# EAGLE design StartStopSwitch (EAGLE 9.0.0)
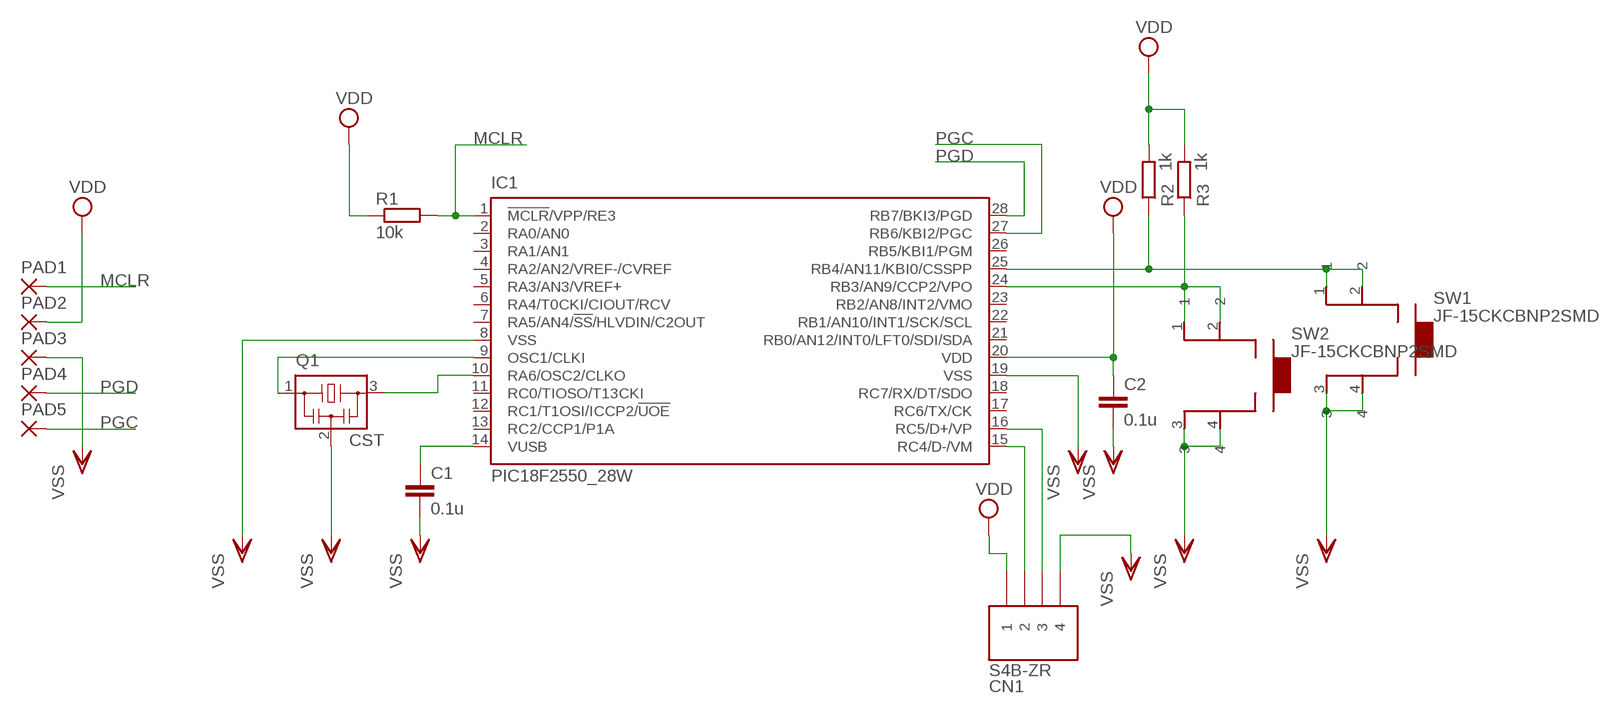
[diagram p0: schematic, sheet 1]

## Parts
C1  0.1u  C-EUC2012  [C2012]
C2  0.1u  C-EUC2012  [C2012]
CN1  S4B-ZR  [S4B-ZR]
IC1  PIC18F2550_28W  [SO28W]
PAD1  WIREPADSMD1,27-254  [SMD1,27-2,54]
PAD2  WIREPADSMD1,27-254  [SMD1,27-2,54]
PAD3  WIREPADSMD1,27-254  [SMD1,27-2,54]
PAD4  WIREPADSMD1,27-254  [SMD1,27-2,54]
PAD5  WIREPADSMD1,27-254  [SMD1,27-2,54]
Q1  CST  CSTCRMINI  [CSTCR6M-MINI]
R1  10k  R-EU_R0805  [R0805]
R2  1k  R-EU_R0805  [R0805]
R3  1k  R-EU_R0805  [R0805]
SW1  JF-15CKCBNP2SMD  [JF-15CKCBNP2-SMD]
SW2  JF-15CKCBNP2SMD  [JF-15CKCBNP2-SMD]

## Nets
24: IC1.24(RB3/AN9/CCP2/VPO) R3.1 SW2.1 SW2.2
25: IC1.25(RB4/AN11/KBI0/CSSPP) R2.1 SW1.1 SW1.2
D+: CN1.3 IC1.16(RC5/D+/VP)
D-: CN1.2 IC1.15(RC4/D-/VM)
MCLR: IC1.1(!MCLR!/VPP/RE3) PAD1.1(P) R1.2
N$1: C1.1 IC1.14(VUSB)
N$2: IC1.9(OSC1/CLKI) Q1.1
N$3: IC1.10(RA6/OSC2/CLKO) Q1.3
PGC: IC1.27(RB6/KBI2/PGC) PAD5.1(P)
PGD: IC1.28(RB7/BKI3/PGD) PAD4.1(P)
VDD: C2.1 CN1.1 IC1.20(VDD) PAD2.1(P) R1.1 R2.2 R3.2
VSS: C1.2 C2.2 CN1.4 IC1.8(VSS) IC1.19(VSS) PAD3.1(P) Q1.2 SW1.3 SW1.4 SW2.3 SW2.4
Unconnected: IC1.2(RA0/AN0) IC1.3(RA1/AN1) IC1.4(RA2/AN2/VREF-/CVREF) IC1.5(RA3/AN3/VREF+) IC1.6(RA4/T0CKI/CIOUT/RCV) IC1.7(RA5/AN4/!SS!/HLVDIN/C2OUT) IC1.11(RC0/TIOSO/T13CKI) IC1.12(RC1/T1OSI/ICCP2/!UOE) IC1.13(RC2/CCP1/P1A) IC1.17(RC6/TX/CK) IC1.18(RC7/RX/DT/SDO) IC1.21(RB0/AN12/INT0/LFT0/SDI/SDA) IC1.22(RB1/AN10/INT1/SCK/SCL) IC1.23(RB2/AN8/INT2/VMO) IC1.26(RB5/KBI1/PGM)

## Library data of the parts
C1 C2 = rcl:C-EU: CAPACITOR, European symbol
CN1 = robocup:S4B
IC1 = microchip:PIC18F2*_28: USB Microcontrollers with nanoWatt Technology High-Performance, Enhanced Flash, 28/40/44-Pin, Source: http://ww1.microchip.com/downloads/en/devicedoc/39632c.pdf; MF: MICROCHIP; MPN: PIC18F2550-I/SO; OC_FARNELL: 9321268; OC_NEWARK: 73K1297
PAD1-PAD5 = wirepad:WIREPAD: Wire PAD connect wire on PCB
Q1 = murata-filter:CSTCR: Resonator Source: murata.co.jp
R1-R3 = resistor:R-EU_: RESISTOR, European symbol
SW1 SW2 = nkk-JF15CKCBNP2:JF-15CKCBNP2: JF-15CKCBNP2

## Board
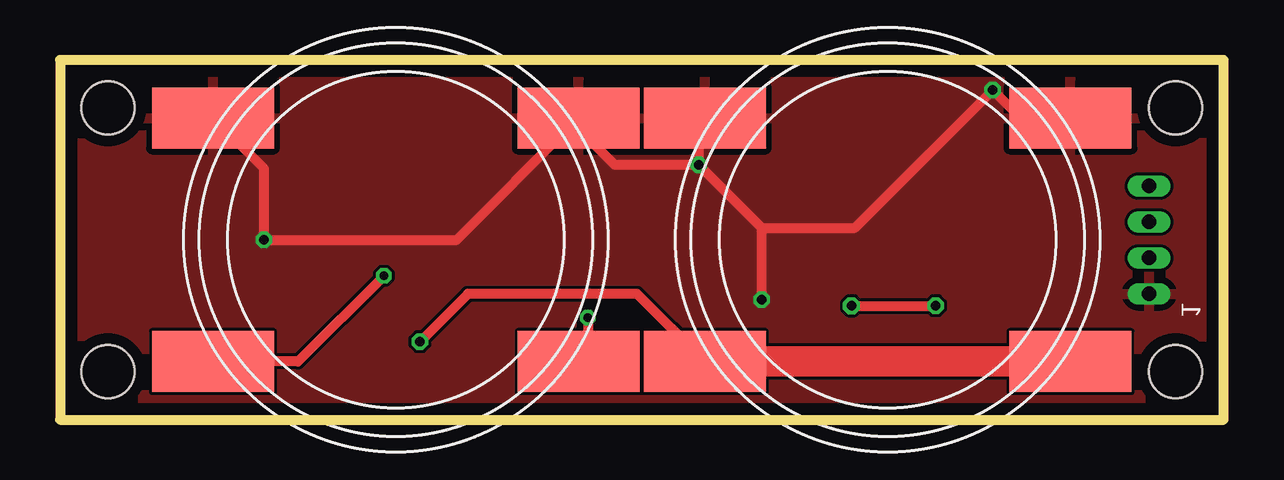
[diagram p1: board, top side]
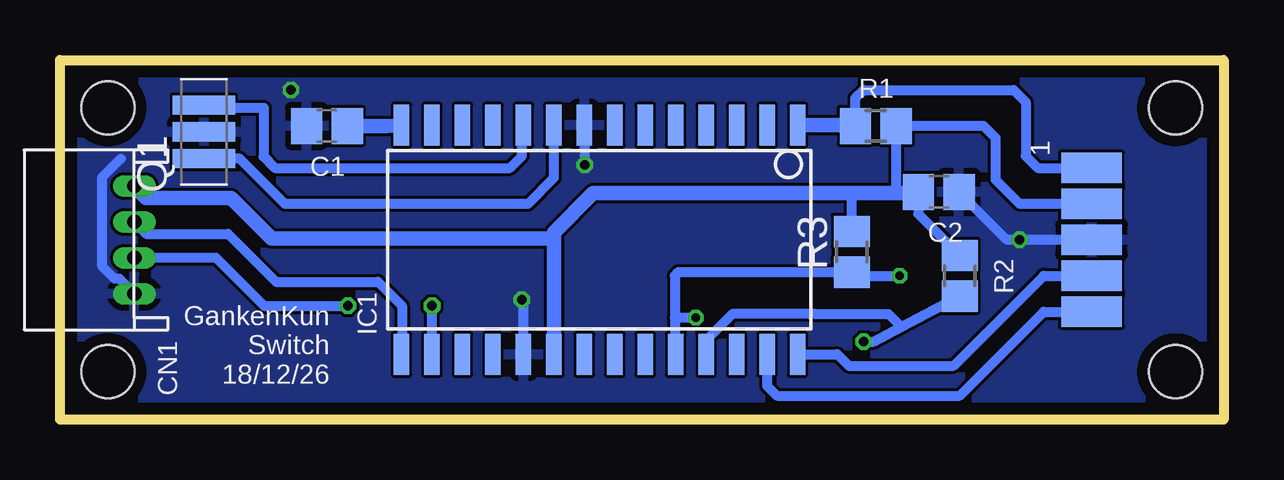
[diagram p2: board, bottom side, seen from below]

Size 48.5 x 15 mm. Coordinates in mm from the lower left corner, seen from the top.
Outline: 48.5,15 0,15 0,0 48.5,0 48.5,15
Copper layers (1*16): Top 0.035mm / dielectric 1.53mm / Bottom 0.035mm
Design rules "pban_5mil-l2": minimum track width 5mil, minimum drill 0.3mm, track to track 5mil, track to pad 0.229mm, pad to pad 5mil, via to via 5mil, smd to smd 5mil, copper to edge 0.5mm, drill to drill 0.5mm, minimum pad ring 0.15mm, minimum via ring 0.15mm, stop-mask expansion 4mil, vias tented up to drill 0.35mm, thermal gap 10mil
Holes 2.2 mm at 46.5,13 46.5,2 2,2 2,13

### Footprints (pad centres in the part's own frame; a part is rotated, then mirrored left to right if it is on the bottom)
C2012 = smd 1.3 x 1.5: 1 -0.85,0; 2 0.85,0
S4B-ZR = drill 0.6 long: 1 2.25,-1.6; 2 0.75,-1.6; 3 -0.75,-1.6; 4 -2.25,-1.6
SO28W = smd 0.65 x 1.7: 1 -7.62,-4.78; 2 -6.35,-4.78; 3 -5.08,-4.78; 4 -3.81,-4.78; 5 -2.54,-4.78; 6 -1.27,-4.78; 7 0,-4.78; 8 1.27,-4.78; 9 2.54,-4.78; 10 3.81,-4.78; 11 5.08,-4.78; 12 6.35,-4.78; 13 7.62,-4.78; 14 8.89,-4.78; 15 8.89,4.78; 16 7.62,4.78; 17 6.35,4.78; 18 5.08,4.78; 19 3.81,4.78; 20 2.54,4.78; 21 1.27,4.78; 22 0,4.78; 23 -1.27,4.78; 24 -2.54,4.78; 25 -3.81,4.78; 26 -5.08,4.78; 27 -6.35,4.78; 28 -7.62,4.78
SMD1,27-2,54 = smd 1.27 x 2.54: 1 0,0
CSTCR6M-MINI = smd 0.8 x 2.6: 1 -1.119,0; 2 0,0; 3 1.119,0
R0805 = smd 1.3 x 1.5: 1 -0.85,0; 2 0.85,0
JF-15CKCBNP2-SMD = smd 2.54 x 5.08: 1 5.08,7.62; 2 5.08,-7.62; 3 -5.08,7.62; 4 -5.08,-7.62

### Placement (x,y rotation side)
C1  37.38,12.25 180 bottom
C2  11.88,9.5 0 bottom
CN1  47,7.5 90 bottom
IC1  25.38,7.5 180 bottom
PAD1  5.5,10.5 90 bottom
PAD2  5.5,9 90 bottom
PAD3  5.5,7.5 90 bottom
PAD4  5.5,6 90 bottom
PAD5  5.5,4.5 90 bottom
Q1  42.5,12 90 bottom
R1  14.5,12.25 180 bottom
R2  11,6 90 bottom
R3  15.5,7 90 bottom
SW1  34.5,7.5 270 top
SW2  14,7.5 270 top

### Tracks (layer width: path | path; a pad name or v marks a point on that pad's centre or on a via)
24  (via drill 0.35)
  Top 0.406: v13.5,6 9.92,2.42 SW2.2 | v22,4.25 22,2.8 SW2.1
  Bottom 0.406: v13.5,6 15.35,6 R3.1 22.73,6.15 22.88,6 22.88,4.25 | 22.88,4.25 22.88,2.76 IC1.24 | 22.34,4.25 v22,4.25 22.88,4.25
25  (via drill 0.4)
  Top 0.406: v15,3.25 17,5.25 24.05,5.25 SW1.2
  Top 1.27: SW1.2 SW1.1
  Bottom 0.406: IC1.25 21.57,3.31 20.48,4.4 17.25,4.4 17,4.4 13.96,4.4 13.43,3.87 | v15,3.25 14.6,3.25 13.43,3.87 | 13.43,3.87 R2.1
D+  (via drill 0.4)
  Top 0.406: v33,4.75 v36.5,4.75
  Bottom 0.406: IC1.16 v33,4.75 | v36.5,4.75 40,4.75 42,6.75 CN1.3
D-
  Bottom 0.406: CN1.2 44.9,7.75 41.5,7.75 39.5,5.75 35.25,5.75 34.25,4.75 34.25,2.73 IC1.15
MCLR
  Bottom 0.406: R1.2 15.35,13.4 15,13.75 8.75,13.75 8.25,13.25 8.25,11 7.75,10.5 PAD1.1
  Bottom 0.61: R1.2 15.35,12.28 IC1.1
N$1
  Bottom 0.61: C1.1 34.89,12.25 IC1.14
N$2
  Bottom 0.406: IC1.9 27.91,10.09 29,9 39.12,9 41.01,10.88 Q1.1
N$3
  Bottom 0.406: IC1.10 29.25,12.21 29.25,11 29.75,10.5 39.55,10.5 40.02,10.97 40,10.99 40,13 41.75,13 41.87,13.12 Q1.3
PGC
  Bottom 0.406: IC1.27 19.02,1.4 18.62,1 11,1 7.5,4.5 PAD5.1
PGD
  Bottom 0.406: PAD4.1 7.5,6 11.25,2.25 15.62,2.25 16.09,2.72 IC1.28
VDD
  Bottom 0.406: PAD2.1 8.5,9 9.5,10 9.5,11.75 10,12.25 R1.1 13.65,9.5 C2.1 12.72,8.57 11.33,7.18 11.02,7.18 10.77,6.93 10.77,6.62 R2.2 | 13.78,9.45 14.2,9.45 | R3.2 15.5,9.45
  Bottom 0.61: CN1.1 44.9,9.25 41.38,9.25 39.69,7.56 27.91,7.56 | C2.1 12.78,9.45 13.78,9.45 15.5,9.45 26.28,9.45 27.91,7.81 27.91,7.56 | IC1.20 27.91,7.56
VSS  (via drill 0.4)
  Top 0.406: SW1.3 40.05,12.58 v38.88,13.75 33.12,8 29.25,8 | SW2.4 8.5,10.46 v8.5,7.5 16.54,7.5 21.39,12.36 | 21.39,12.36 SW2.3 | v29.25,5 29.25,8 | 29.25,8 v26.62,10.62 | SW1.4 26.62,12.32 v26.62,10.62 | v26.62,10.62 23.12,10.62 21.39,12.36
  Bottom 0.406: CN1.4 46.02,5.87 46.22,5.87 46.73,6.38 46.73,10.12 45.97,10.88 | PAD3.1 v8.5,7.5 9.03,7.5 C2.2 | IC1.19 29.18,4.93 v29.25,5 | v26.62,10.62 26.62,12.26 IC1.8
  pour Bottom: 48.5,15 0,15 0,0 48.5,0
  pour Top: 48.5,15 0,15 0,0 48.5,0

### Text on the board
tNames: 1
bNames: 1 | GankenKun / Switch / 18/12/26